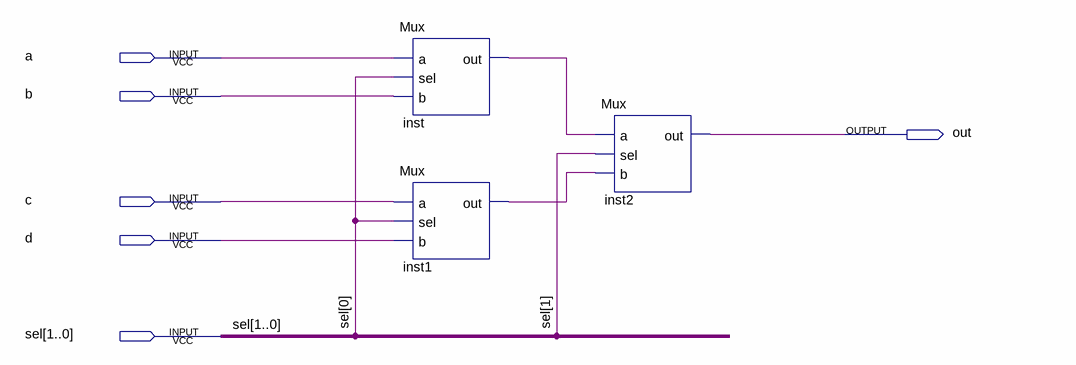
[diagram p0: schematic sheet]
// Quartus schematic Mux4Way.bdf as structural Verilog: 3 symbols, 6 pins
module Mux4Way (
  input  a,
  input  b,
  input  c,
  input  d,
  input  [1:0] sel,
  output out
);

  wire inst1_out, inst_out;

  Mux inst (.a(a), .sel(sel[0]), .b(b), .out(inst_out));
  Mux inst1 (.a(c), .sel(sel[0]), .b(d), .out(inst1_out));
  Mux inst2 (.a(inst_out), .sel(sel[1]), .b(inst1_out), .out(out));
endmodule
